# Altium schematic sheet LPCB235 - DAC.SchDoc
size A3; Address1: Factory 10; Address2: 9-13 Dingley Avenue, Dandeong, VICTORIA 3175, AUSTRALIA; DocumentNumber: 10; Revision: 1; SheetNumber: 10; SheetTotal: 37; Lockie__PCB_SUB_ASSEMBLY: DAC; Lockie__PCB_ASSEMBLY: FCU PCB; Lockie__LDL: LPCB235; Lockie__PCB_DESCRIPTION: Flight Control Unit
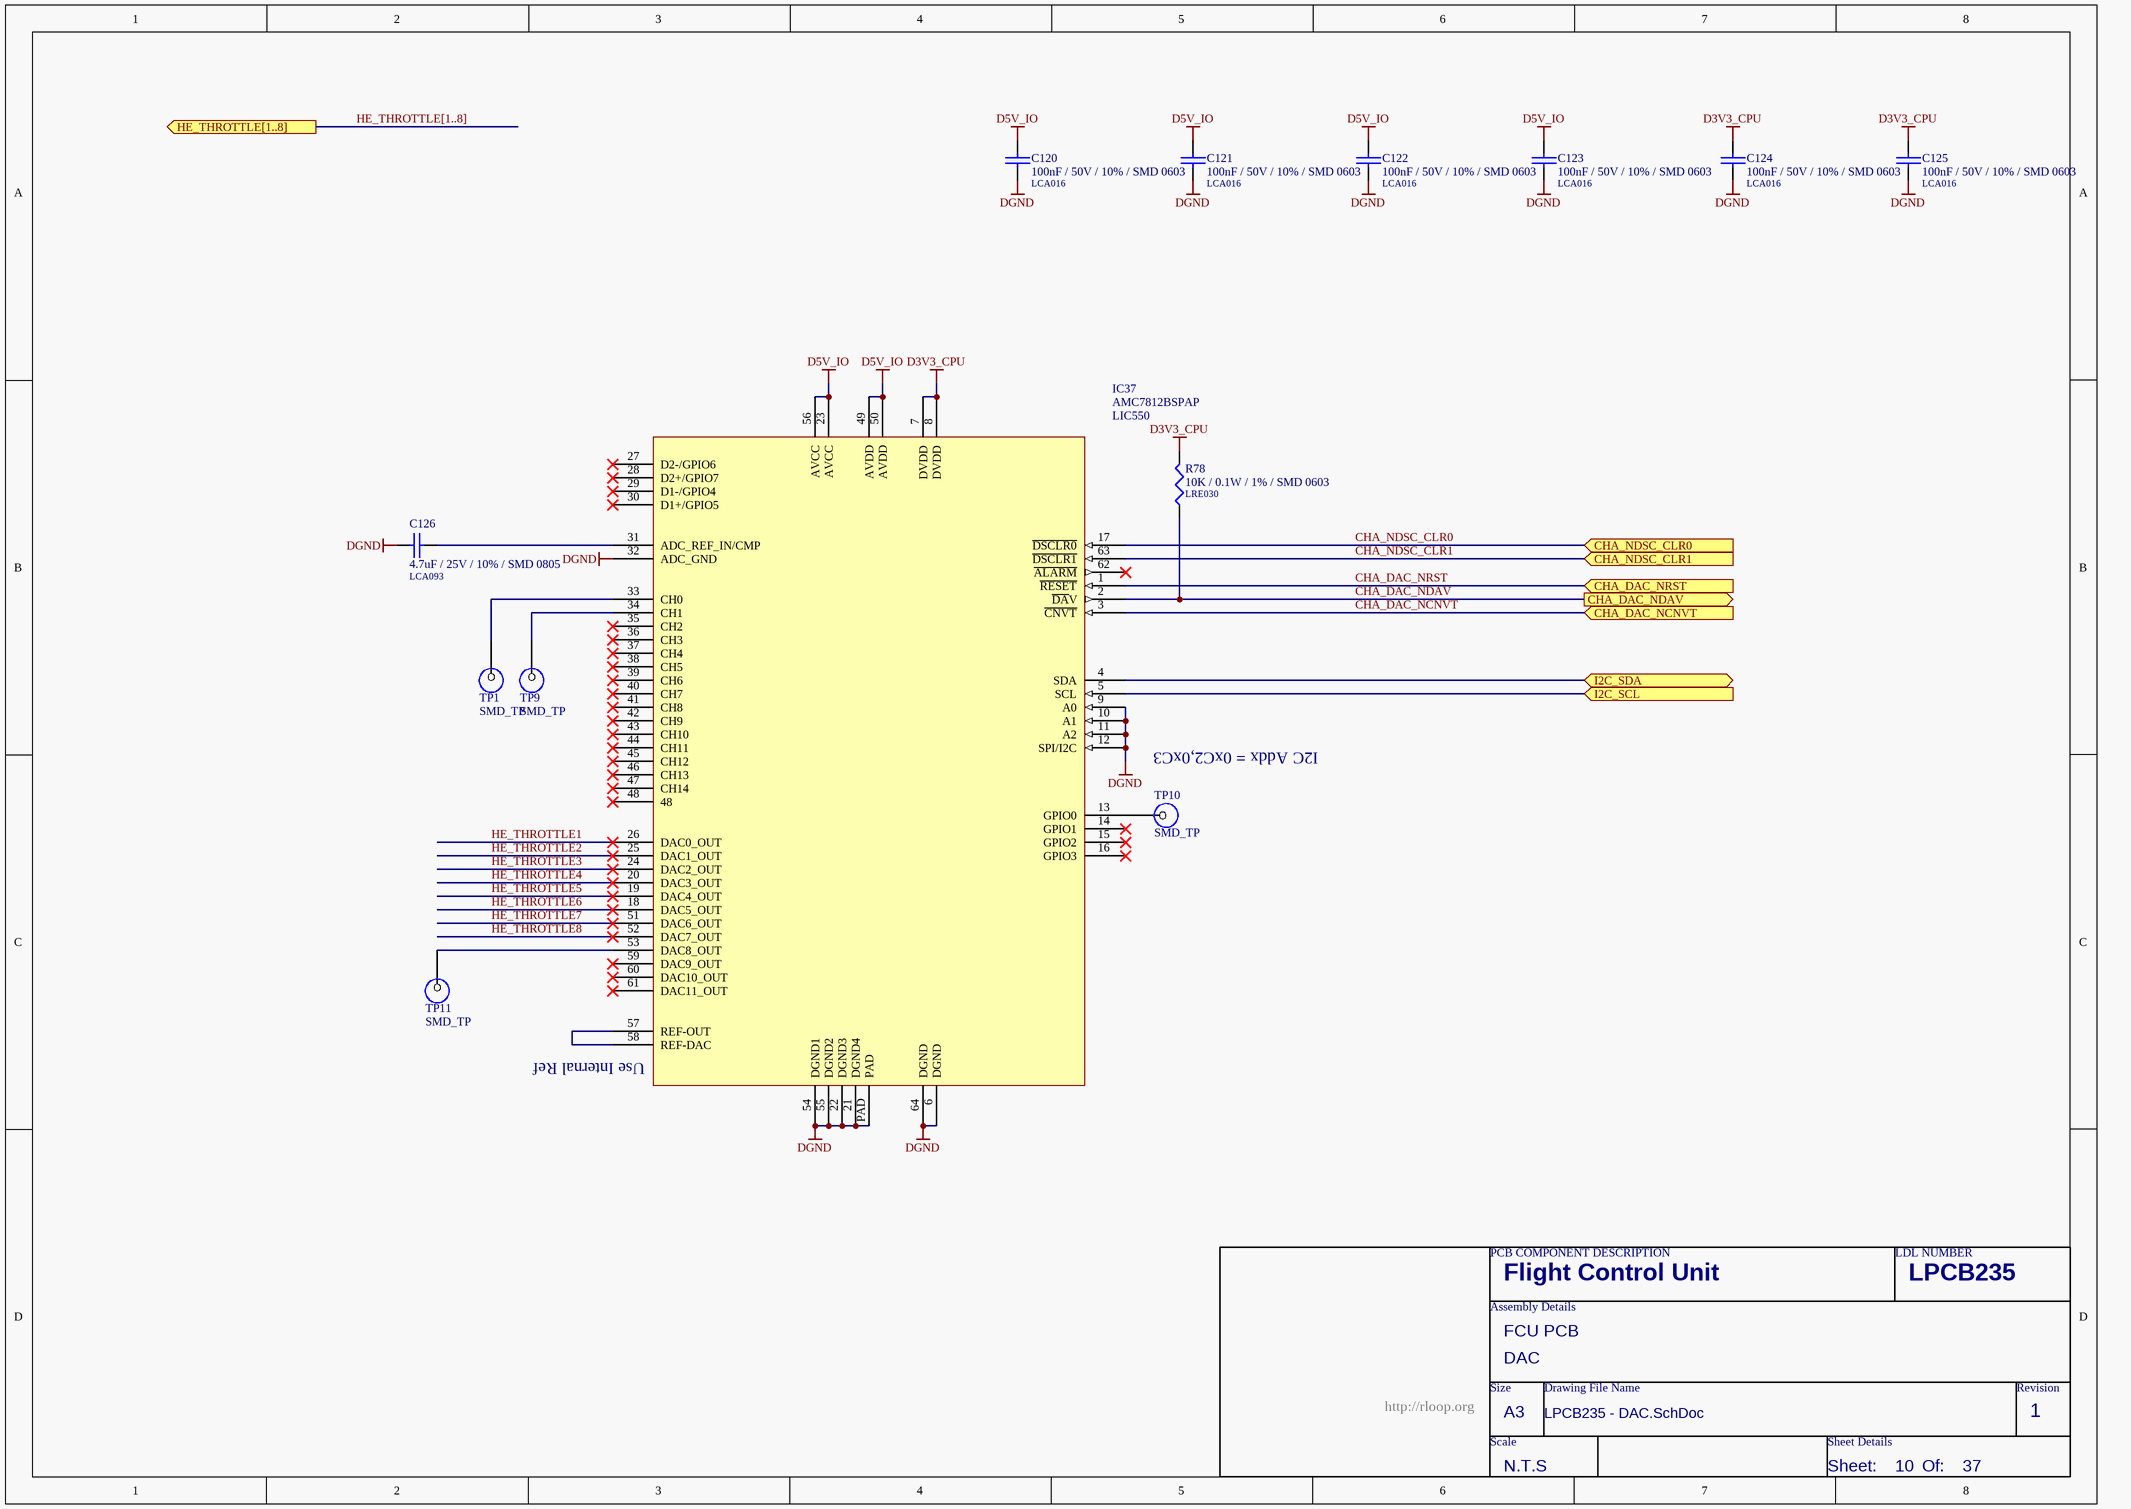
[diagram p0: LPCB235 - DAC.SchDoc]

## Parts
C120  100nF / 50V / 10% / SMD 0603  LDL_NUMBER: LCA016  [LFP011__CC1608-0603-IPC7351_B]
C121  100nF / 50V / 10% / SMD 0603  LDL_NUMBER: LCA016  [LFP011__CC1608-0603-IPC7351_B]
C122  100nF / 50V / 10% / SMD 0603  LDL_NUMBER: LCA016  [LFP011__CC1608-0603-IPC7351_B]
C123  100nF / 50V / 10% / SMD 0603  LDL_NUMBER: LCA016  [LFP011__CC1608-0603-IPC7351_B]
C124  100nF / 50V / 10% / SMD 0603  LDL_NUMBER: LCA016  [LFP011__CC1608-0603-IPC7351_B]
C125  100nF / 50V / 10% / SMD 0603  LDL_NUMBER: LCA016  [LFP011__CC1608-0603-IPC7351_B]
C126  4.7uF / 25V / 10% / SMD 0805  LDL_NUMBER: LCA093  [LFP010__CC2012-0805-IPC7351_B]
IC37  AMC7812BSPAP  LDL_NUMBER: LIC550  [LFP134__H-QFP10X10-64N]
R78  10K / 0.1W / 1% / SMD 0603  LDL_NUMBER: LRE030  [LFP020__CR1608-0603-IPC7351_B]
TP1  SMD_TP  [SMD-TP]  (no BOM)
TP9  SMD_TP  [SMD-TP]  (no BOM)
TP10  SMD_TP  [SMD-TP]  (no BOM)
TP11  SMD_TP  [SMD-TP]  (no BOM)

## Ports
CHA_DAC_NCNVT (in), CHA_DAC_NDAV (out), CHA_DAC_NRST (in), CHA_NDSC_CLR0 (in), CHA_NDSC_CLR1 (in), HE_THROTTLE[1..8] (out), I2C_SCL (in), I2C_SDA (bidir)

## Nets
D3V3_CPU: C124.1 C125.1 IC37.7(DVDD) IC37.8(DVDD) R78.2
D5V_IO: C120.1 C121.1 C122.1 C123.1 IC37.23(AVCC) IC37.49(AVDD) IC37.50(AVDD) IC37.56(AVCC)
DGND: C120.2 C121.2 C122.2 C123.2 C124.2 C125.2 C126.1 IC37.6(DGND) IC37.9(A0) IC37.10(A1) IC37.11(A2) IC37.12(SPI/I2C) IC37.21(DGND4) IC37.22(DGND3) IC37.32(ADC_GND) IC37.54(DGND1) IC37.55(DGND2) IC37.64(DGND) IC37.PAD
CHA_DAC_NCNVT: IC37.3(~{CNVT}) ; port CHA_DAC_NCNVT
CHA_DAC_NDAV: IC37.2(~{DA}V) R78.1 ; port CHA_DAC_NDAV
CHA_DAC_NRST: IC37.1(~{RESET}) ; port CHA_DAC_NRST
CHA_NDSC_CLR0: IC37.17(~{DSCLR0}) ; port CHA_NDSC_CLR0
CHA_NDSC_CLR1: IC37.63(~{DSCLR1}) ; port CHA_NDSC_CLR1
HE_THROTTLE1: IC37.26(DAC0_OUT)
HE_THROTTLE2: IC37.25(DAC1_OUT)
HE_THROTTLE3: IC37.24(DAC2_OUT)
HE_THROTTLE4: IC37.20(DAC3_OUT)
HE_THROTTLE5: IC37.19(DAC4_OUT)
HE_THROTTLE6: IC37.18(DAC5_OUT)
HE_THROTTLE7: IC37.51(DAC6_OUT)
HE_THROTTLE8: IC37.52(DAC7_OUT)
I2C_SCL: IC37.5(SCL) ; port I2C_SCL
I2C_SDA: IC37.4(SDA) ; port I2C_SDA
NetC126_2: C126.2 IC37.31(ADC_REF_IN/CMP)
NetIC37_13: IC37.13(GPIO0) TP10.1
NetIC37_33: IC37.33(CH0) TP1.1
NetIC37_34: IC37.34(CH1) TP9.1
NetIC37_53: IC37.53(DAC8_OUT) TP11.1
NetIC37_57: IC37.57(REF-OUT) IC37.58(REF-DAC)

Not connected (* = marked no-connect by the designer): IC37 14(GPIO1)* 15(GPIO2)* 16(GPIO3)* 27(D2-/GPIO6)* 28(D2+/GPIO7)* 29(D1-/GPIO4)* 30(D1+/GPIO5)* 35(CH2)* 36(CH3)* 37(CH4)* 38(CH5)* 39(CH6)* 40(CH7)* 41(CH8)* 42(CH9)* 43(CH10)* 44(CH11)* 45(CH12)* 46(CH13)* 47(CH14)* 48* 59(DAC9_OUT)* 60(DAC10_OUT)* 61(DAC11_OUT)* 62(~{ALARM})*

## Buses and harness runs
bus HE_THROTTLE[1..8] = port HE_THROTTLE[1..8]

## Notes on the sheet
- I2C Addx = 0xC2,0xC3
- (near IC37) Use Internal Ref
- PCB COMPONENT DESCRIPTION
- LDL NUMBER
- Assembly Details
- Size
- Drawing File Name
- Revision
- http://rloop.org
- Scale
- A3
- Sheet Details
- N.T.S
- Sheet:
- Of:

## Library data of the parts
C120-C125 = 100nF / 50V / 10% / SMD 0603: Capacitor, Ceramic Chip, 100nF (0.1uF), 50V, 5%, SMD 0603 [LCA016]; Value: 100n; FMEDA__OPERATING__VOLTAGE_MIN: 0; FMEDA__OPERATING__VOLTAGE_MAX: 3.3; FMEDA__OPERATING__TEMP_MIN: -20; FMEDA__OPERATING__TEMP_TYP: 27; FMEDA__OPERATING__TEMP_MAX: 50; FMEDA__CHANNEL: COM; FMEDA__FUNCTION_IN_SYSTEM: *; FMEDA__OPERATING__VOLTAGE_TYP: 3.3
C126 = 4.7uF / 25V / 10% / SMD 0805: Capacitor, Ceramic Chip, 4.7uF, 25V, 10%, SMD 0805 [LCA093]; Value: 4.7u; FMEDA__OPERATING__TEMP_MAX: 50; FMEDA__OPERATING__TEMP_MIN: -20; FMEDA__OPERATING__TEMP_TYP: 27; FMEDA__OPERATING__VOLTAGE_MAX: 0; FMEDA__CHANNEL: COM; FMEDA__OPERATING__VOLTAGE_MIN: 0; FMEDA__OPERATING__VOLTAGE_TYP: 0; FMEDA__FUNCTION_IN_SYSTEM: *
IC37 = AMC7812BSPAP: IC, ADC / DAC, SMD [LIC550]
R78 = 10K / 0.1W / 1% / SMD 0603: Resistor, Ceramic Chip, 10K, 0.1W, 1%, SMD 0603 [LRE030]; FMEDA__OPERATING__POWER_MAX: 0; FMEDA__OPERATING__TEMP_MAX: 50; FMEDA__OPERATING__TEMP_MIN: -20; FMEDA__OPERATING__TEMP_TYP: 27; FMEDA__CHANNEL: COM; Value: 10K; FMEDA__OPERATING__POWER_MIN: 0; FMEDA__OPERATING__VOLTAGE_MAX: 0; FMEDA__OPERATING__VOLTAGE_MIN: 0; FMEDA__OPERATING__VOLTAGE_TYP: 0; FMEDA__FUNCTION_IN_SYSTEM: *
TP1 TP9-TP11 = SMD_TP: SMD Test Point; FMEDA__CHANNEL: COM; FMEDA__OPERATING__CURRENT_MAX: 0; FMEDA__OPERATING__TEMP_MAX: 50; FMEDA__OPERATING__TEMP_MIN: -20; FMEDA__OPERATING__TEMP_TYP: 27; FMEDA__OPERATING__VOLTAGE_MAX: 16; FMEDA__OPERATING__VOLTAGE_TYP: 12; FMEDA__OPERATING__CURRENT_MIN: 0; FMEDA__OPERATING__CURRENT_TYP: 0; FMEDA__OPERATING__VOLTAGE_MIN: 0